# Altium schematic sheet TopLevelSketch.SchDoc
size A
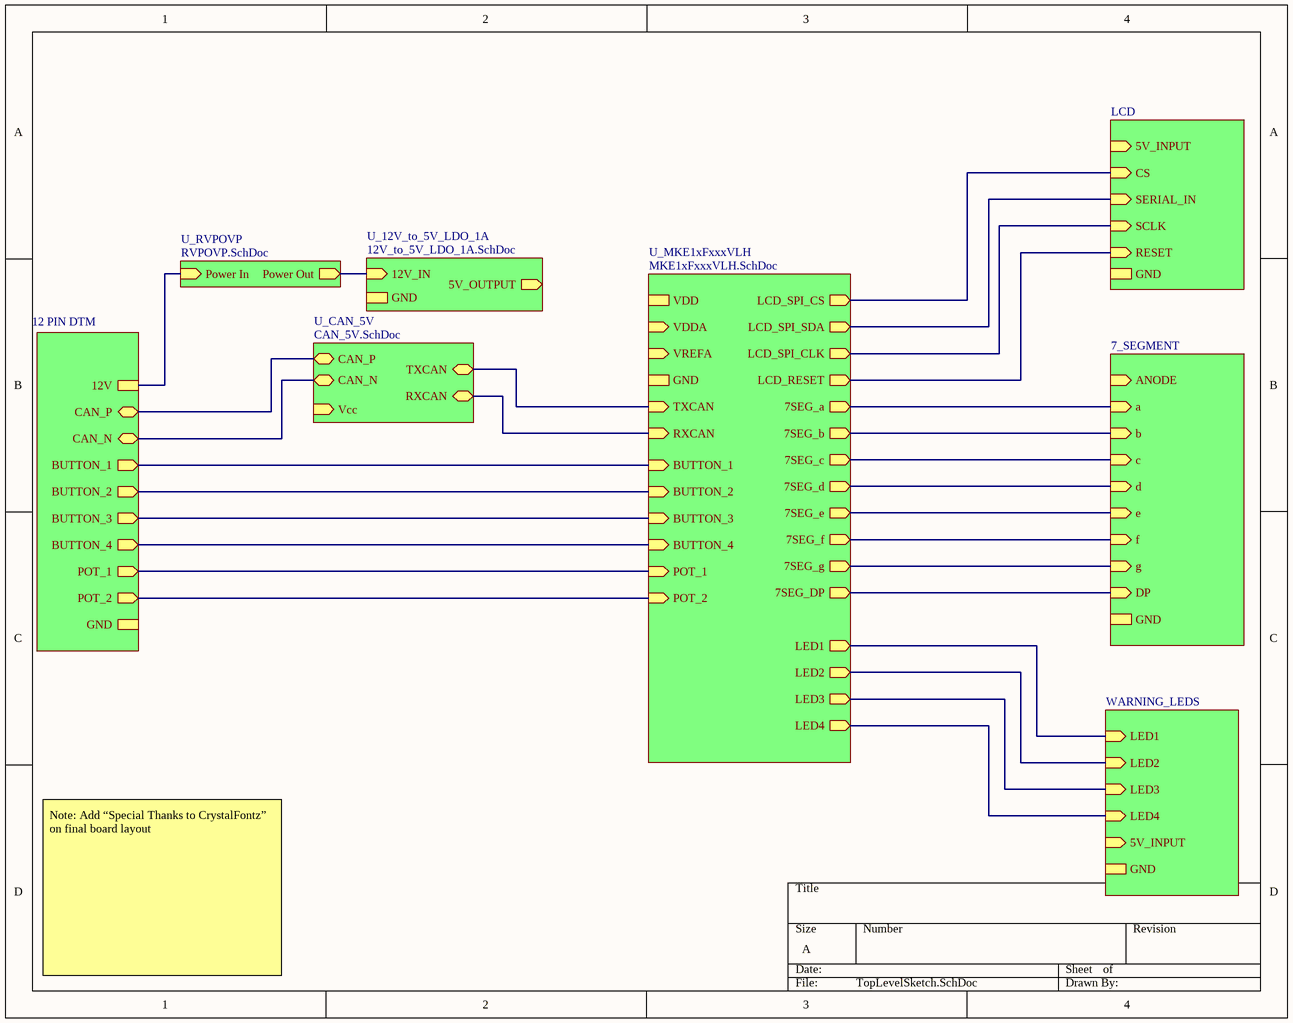
[diagram p0: TopLevelSketch.SchDoc]

## Sub-sheets
12 PIN DTM = File Name: 12V, CAN_P (bidir), CAN_N (bidir), BUTTON_1 (out), BUTTON_2 (out), BUTTON_3 (out), BUTTON_4 (out), POT_1 (out), POT_2 (out), GND
Designator = 7_SEGMENT: ANODE (in), a (in), b (in), c (in), d (in), e (in), f (in), g (in), DP (in), GND
Designator = WARNING_LEDS: LED1 (in), LED2 (in), LED3 (in), LED4 (in), 5V_INPUT (in), GND
LCD = File Name: 5V_INPUT (in), CS (in), SERIAL_IN (in), SCLK (in), RESET (in), GND
U_12V_to_5V_LDO_1A = 12V_to_5V_LDO_1A.SchDoc: 12V_IN (in), 5V_OUTPUT (out), GND
U_CAN_5V = CAN_5V.SchDoc: TXCAN (bidir), RXCAN (bidir), CAN_N (bidir), CAN_P (bidir), Vcc (in)
U_MKE1xFxxxVLH = MKE1xFxxxVLH.SchDoc: VDD, VDDA (in), VREFA (in), GND, TXCAN (in), RXCAN (in), BUTTON_1 (in), BUTTON_2 (in), BUTTON_3 (in), BUTTON_4 (in), POT_1 (in), POT_2 (in), LCD_SPI_CS (out), LCD_SPI_SDA (out), LCD_SPI_CLK (out), LCD_RESET (out), 7SEG_a (out), 7SEG_b (out), 7SEG_c (out), 7SEG_d (out), 7SEG_e (out), 7SEG_f (out), 7SEG_g (out), 7SEG_DP (out), LED1 (out), LED2 (out), LED3 (out), LED4 (out)
U_RVPOVP = RVPOVP.SchDoc: Power Out (out), Power In (in)

## Nets
(unnamed): sheet 12 PIN DTM/12V, sheet U_RVPOVP/Power In
(unnamed): sheet 12 PIN DTM/CAN_P, sheet U_CAN_5V/CAN_P
(unnamed): sheet 12 PIN DTM/CAN_N, sheet U_CAN_5V/CAN_N
(unnamed): sheet 12 PIN DTM/BUTTON_1, sheet U_MKE1xFxxxVLH/BUTTON_1
(unnamed): sheet 12 PIN DTM/BUTTON_2, sheet U_MKE1xFxxxVLH/BUTTON_2
(unnamed): sheet 12 PIN DTM/BUTTON_3, sheet U_MKE1xFxxxVLH/BUTTON_3
(unnamed): sheet 12 PIN DTM/BUTTON_4, sheet U_MKE1xFxxxVLH/BUTTON_4
(unnamed): sheet 12 PIN DTM/POT_1, sheet U_MKE1xFxxxVLH/POT_1
(unnamed): sheet 12 PIN DTM/POT_2, sheet U_MKE1xFxxxVLH/POT_2
(unnamed): sheet LCD/CS, sheet U_MKE1xFxxxVLH/LCD_SPI_CS
(unnamed): sheet LCD/SERIAL_IN, sheet U_MKE1xFxxxVLH/LCD_SPI_SDA
(unnamed): sheet LCD/SCLK, sheet U_MKE1xFxxxVLH/LCD_SPI_CLK
(unnamed): sheet LCD/RESET, sheet U_MKE1xFxxxVLH/LCD_RESET
(unnamed): sheet U_12V_to_5V_LDO_1A/12V_IN, sheet U_RVPOVP/Power Out
(unnamed): sheet Designator/a, sheet U_MKE1xFxxxVLH/7SEG_a
(unnamed): sheet Designator/b, sheet U_MKE1xFxxxVLH/7SEG_b
(unnamed): sheet Designator/c, sheet U_MKE1xFxxxVLH/7SEG_c
(unnamed): sheet Designator/d, sheet U_MKE1xFxxxVLH/7SEG_d
(unnamed): sheet Designator/e, sheet U_MKE1xFxxxVLH/7SEG_e
(unnamed): sheet Designator/f, sheet U_MKE1xFxxxVLH/7SEG_f
(unnamed): sheet Designator/g, sheet U_MKE1xFxxxVLH/7SEG_g
(unnamed): sheet Designator/DP, sheet U_MKE1xFxxxVLH/7SEG_DP
(unnamed): sheet Designator/LED1, sheet U_MKE1xFxxxVLH/LED1
(unnamed): sheet Designator/LED2, sheet U_MKE1xFxxxVLH/LED2
(unnamed): sheet Designator/LED3, sheet U_MKE1xFxxxVLH/LED3
(unnamed): sheet Designator/LED4, sheet U_MKE1xFxxxVLH/LED4
(unnamed): sheet U_CAN_5V/TXCAN, sheet U_MKE1xFxxxVLH/TXCAN
(unnamed): sheet U_CAN_5V/RXCAN, sheet U_MKE1xFxxxVLH/RXCAN

## Notes on the sheet
- Note: Add “Special Thanks to CrystalFontz” on final board layout